# Altium project DM3370.PrjPcb (part 14 of 14)
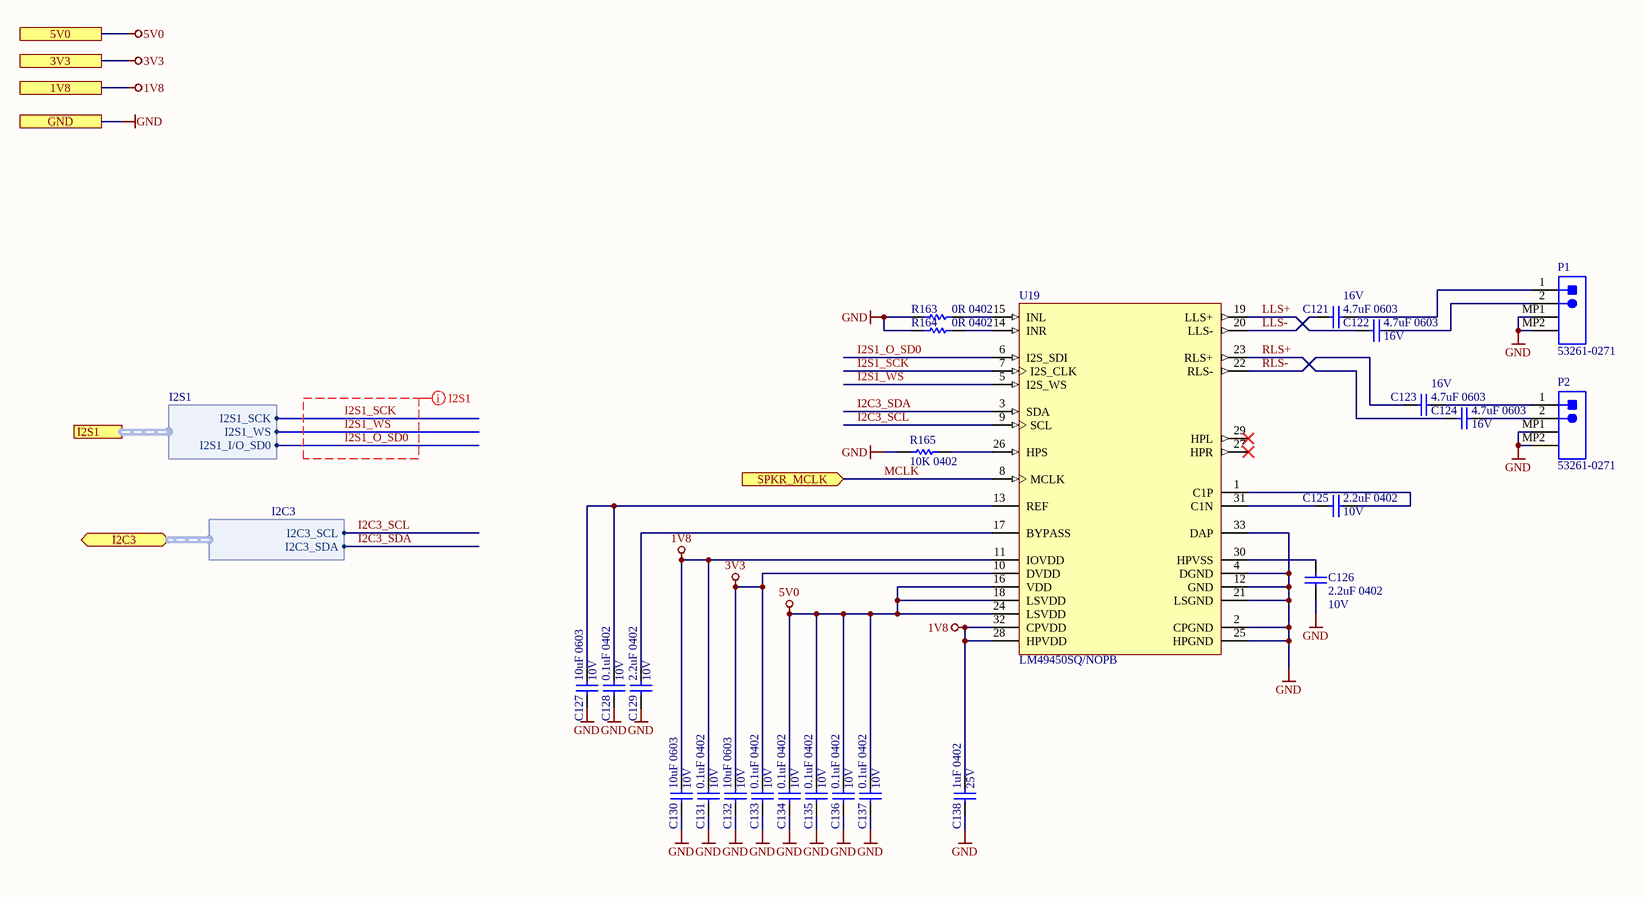
[diagram p18: DM3370_speaker.SchDoc]

## Nets that join several sheets
1V0: DM3370_IMX214 (FB6.1), DM3370_Power (C119.2 R64.2 TP33.1 U10.10)
1V2: DM3370_OV9782_1-2 (FB9.1 FB12.1), DM3370_OV9782_3-4 (FB15.1 FB18.1), DM3370_Power (C120.2 R67.1 TP34.1 U10.8)
1V8: DM3370_EEPROM_Add (5 pins), DM3370_Connector_B (9 pins), DM3370_Connector_C (R52.1), DM3370_IMU_BMI270 (9 pins), DM3370_LCD_LEDring (11 pins), DM3370_Motor (9 pins), DM3370_OV9782_1-2 (FB8.1 FB11.1), DM3370_OV9782_3-4 (FB14.1 FB17.1), DM3370_PCIe (10 pins), DM3370_IMX214 (FB5.1), DM3370_Power (5 pins), DM3370_I2S_MICS (6 pins), DM3370_speaker (6 pins)
2V8: DM3370_LCD_LEDring (FB19.1), DM3370_OV9782_1-2 (R19.1 R170.1), DM3370_OV9782_3-4 (R177.1 R178.1), DM3370_IMX214 (R199.1), DM3370_Power (C31.2 TP2.1 U7.5)
3V3: DM3370_IMU_BMI270 (5 pins), DM3370_LCD_LEDring (FB7.1), DM3370_PCIe (9 pins), DM3370_Power (5 pins), DM3370_USB (26 pins), DM3370_PCIE_CLK (30 pins), DM3370_speaker (C132.2 C133.2 U19.10)
5V0: DM3370_Connector_B (J3.30), DM3370_Connector_C (R4.2), DM3370_LCD_LEDring (7 pins), DM3370_Motor (8 pins), DM3370_Power (6 pins), DM3370_USB (8 pins), DM3370_speaker (7 pins)
11V: DM3370_Motor (FB21.1), DM3370_Power (6 pins)
BB_SYS: DM3370_Connector_A (12 pins), DM3370_Power (36 pins)
GND: TopLevel (MTG1.1 MTG2.1 MTG3.1 MTG4.1), DM3370_EEPROM_Add (6 pins), DM3370_Connector_A (31 pins), DM3370_Connector_B (39 pins), DM3370_Connector_C (26 pins), DM3370_IMU_BMI270 (14 pins), DM3370_LCD_LEDring (30 pins), DM3370_Motor (26 pins), DM3370_OV9782_1-2 (35 pins), DM3370_OV9782_3-4 (35 pins), DM3370_PCIe (25 pins), DM3370_IMX214 (18 pins), DM3370_Power (84 pins), DM3370_USB (64 pins), DM3370_PCIE_CLK (38 pins), DM3370_I2S_MICS (21 pins), DM3370_speaker (26 pins)
P_VBUS: DM3370_Power (C139.1 U8.1 U8.24), DM3370_USB (7 pins)
VBAT: DM3370_Connector_A (J1.2), DM3370_Power (12 pins)
BACK_LIGHT: DM3370_Connector_C (J5.50), DM3370_LCD_LEDring (Q7.1 R145.2)
BMI270_CS_1V8: DM3370_Connector_C (J5.70), DM3370_IMU_BMI270 (U1.12 U26.18)
BMI270_INT_1V8: DM3370_Connector_B (J3.61), DM3370_IMU_BMI270 (U1.4 U26.14)
BMI270_MISO_1V8: DM3370_Connector_C (J5.60), DM3370_IMU_BMI270 (U1.1 U26.20)
BMI270_MOSI_1V8: DM3370_Connector_C (J5.58), DM3370_IMU_BMI270 (U1.14 U26.17)
BMI270_SCK_1V8: DM3370_Connector_C (J5.68), DM3370_IMU_BMI270 (U1.13 U26.19)
BMI270_WAKE_1V8: DM3370_Connector_B (J3.65), DM3370_IMU_BMI270 (U1.9 U26.6)
BNO08x_BOOTN_1V8: DM3370_Connector_B (J3.56), DM3370_IMU_BMI270 (R183.1 TP42.1 U26.4)
BNO08x_RSTn_1V8: DM3370_Connector_B (J3.59), DM3370_IMU_BMI270 (U26.11)
CAM_A_CLK: DM3370_Connector_C (J5.38), DM3370_IMX214 (J13.3)
CAM_A_PWR: DM3370_Connector_C (J5.26), DM3370_OV9782_1-2 (J14.9 R131.1)
CAM_D_PWR: DM3370_Connector_C (J5.28), DM3370_OV9782_1-2 (J15.9 R132.1)
CAM_E_PWR: DM3370_Connector_C (J5.66), DM3370_IMX214 (J13.9 R126.1)
CAM_FS_A: DM3370_Connector_C (J5.52 R20.2), DM3370_IMX214 (J13.8)
CAM_FS_ST: DM3370_Connector_C (J5.48 R18.2), DM3370_OV9782_1-2 (R135.2), DM3370_OV9782_3-4 (R144.2)
CAM_L_PWR: DM3370_Connector_C (J5.64), DM3370_OV9782_3-4 (J16.9 R140.1)
CAM_R_PWR: DM3370_Connector_C (J5.62), DM3370_OV9782_3-4 (J17.9 R141.1)
CAM_ST_CLK: DM3370_Connector_C (J5.36), DM3370_OV9782_1-2 (R159.1 R160.1), DM3370_OV9782_3-4 (R161.1 R162.1)
CHG_INT: DM3370_Connector_A (J1.70), DM3370_Power (R70.2 U8.7)
D/C: DM3370_Connector_C (J5.42), DM3370_LCD_LEDring (U25.5)
GGE_INT: DM3370_Connector_A (J1.72), DM3370_Power (R198.2 U18.12)
I2C0_SCL: DM3370_EEPROM_Add (U17.6), DM3370_Connector_A (J1.27), DM3370_OV9782_3-4 (J16.7)
I2C0_SDA: DM3370_EEPROM_Add (U17.5), DM3370_Connector_A (J1.29), DM3370_OV9782_3-4 (J16.5)
I2C1_SCL: DM3370_Connector_B (J3.39), DM3370_OV9782_1-2 (J14.7)
I2C1_SDA: DM3370_Connector_B (J3.41), DM3370_OV9782_1-2 (J14.5)
I2C2_SCL: DM3370_Connector_A (J1.98), DM3370_IMX214 (J13.7)
I2C2_SDA: DM3370_Connector_A (J1.100), DM3370_IMX214 (J13.5)
I2C3_SCL: DM3370_Connector_C (J5.96), DM3370_OV9782_1-2 (J15.7), DM3370_PCIe (U4.4), DM3370_speaker (U19.9)
I2C3_SCL_3V3: DM3370_PCIe (R49.2 R55.1 U4.1), DM3370_PCIE_CLK (U14.19 U15.8)
I2C3_SDA: DM3370_Connector_C (J5.98), DM3370_OV9782_1-2 (J15.5), DM3370_PCIe (U4.5), DM3370_speaker (U19.3)
I2C3_SDA_3V3: DM3370_PCIe (R47.2 R54.1 U4.8), DM3370_PCIE_CLK (U14.20 U15.9)
I2C4_SCL: DM3370_Connector_B (J4.2), DM3370_Connector_C (J5.90), DM3370_OV9782_3-4 (J17.7), DM3370_Power (U8.5 U18.2)
I2C4_SDA: DM3370_Connector_B (J4.4), DM3370_Connector_C (J5.92), DM3370_OV9782_3-4 (J17.5), DM3370_Power (U8.6 U18.1)
I2S0_I/O_SD0: DM3370_Connector_B (J3.49), DM3370_I2S_MICS (MIC1.6 MIC2.6)
I2S0_I/O_SD1: DM3370_Connector_B (J3.47), DM3370_I2S_MICS (MIC3.6 MIC4.6)
I2S0_I/O_SD2: DM3370_Connector_B (J3.53), DM3370_I2S_MICS (MIC5.6 MIC6.6)
I2S0_SCK: DM3370_Connector_B (J3.51), DM3370_I2S_MICS (6 pins)
I2S0_WS: DM3370_Connector_B (J3.45), DM3370_I2S_MICS (6 pins)
I2S1_O_SD0: DM3370_Connector_B (J3.54), DM3370_speaker (U19.6)
I2S1_SCK: DM3370_Connector_C (J5.22), DM3370_speaker (U19.7)
I2S1_WS: DM3370_Connector_C (J5.24), DM3370_speaker (U19.5)
KB_PG: DM3370_Connector_A (J1.36), DM3370_Connector_B (J4.5)
KBIO_40: DM3370_Connector_B (J3.80), DM3370_USB (TP27.1 U13.6)
KBIO_41: DM3370_Connector_B (J3.89), DM3370_Motor (U2.6)
KBIO_42: DM3370_Connector_B (J3.83), DM3370_Motor (U20.4)
KBIO_43: DM3370_Connector_B (J3.85), DM3370_Motor (U20.5)
KBIO_44: DM3370_Connector_B (J3.78), DM3370_USB (Q4.1 R200.2)
KBIO_45: DM3370_Connector_B (J3.91), DM3370_Motor (U3.6)
KBIO_46: DM3370_Connector_B (J3.79), DM3370_Motor (U20.2)
KBIO_47: DM3370_Connector_B (J3.81), DM3370_Motor (U20.3)
MCLK: DM3370_Connector_C (J5.40), DM3370_speaker (U19.8)
MIPI_RX0_C_N: DM3370_Connector_B (J3.84), DM3370_IMX214 (J13.20)
MIPI_RX0_C_P: DM3370_Connector_B (J3.86), DM3370_IMX214 (J13.19)
MIPI_RX0_D0_N: DM3370_Connector_B (J3.96), DM3370_IMX214 (J13.26)
MIPI_RX0_D0_P: DM3370_Connector_B (J3.98), DM3370_IMX214 (J13.25)
MIPI_RX0_D1_N: DM3370_Connector_B (J3.90), DM3370_IMX214 (J13.22)
MIPI_RX0_D1_P: DM3370_Connector_B (J3.92), DM3370_IMX214 (J13.23)
MIPI_RX1_D0_N: DM3370_Connector_B (J3.66), DM3370_IMX214 (J13.16)
MIPI_RX1_D0_P: DM3370_Connector_B (J3.68), DM3370_IMX214 (J13.17)
MIPI_RX1_D1_N: DM3370_Connector_B (J3.60), DM3370_IMX214 (J13.14)
MIPI_RX1_D1_P: DM3370_Connector_B (J3.62), DM3370_IMX214 (J13.13)
MIPI_RX2_C_N: DM3370_Connector_C (J5.79), DM3370_OV9782_3-4 (J16.20)
MIPI_RX2_C_P: DM3370_Connector_C (J5.77), DM3370_OV9782_3-4 (J16.19)
MIPI_RX2_D0_N: DM3370_Connector_C (J5.67), DM3370_OV9782_3-4 (J16.26)
MIPI_RX2_D0_P: DM3370_Connector_C (J5.65), DM3370_OV9782_3-4 (J16.25)
MIPI_RX2_D1_N: DM3370_Connector_C (J5.73), DM3370_OV9782_3-4 (J16.22)
MIPI_RX2_D1_P: DM3370_Connector_C (J5.71), DM3370_OV9782_3-4 (J16.23)
MIPI_RX3_C_N: DM3370_Connector_C (J5.85), DM3370_OV9782_3-4 (J17.20)
MIPI_RX3_C_P: DM3370_Connector_C (J5.83), DM3370_OV9782_3-4 (J17.19)
MIPI_RX3_D0_N: DM3370_Connector_C (J5.91), DM3370_OV9782_3-4 (J17.26)
MIPI_RX3_D0_P: DM3370_Connector_C (J5.89), DM3370_OV9782_3-4 (J17.25)
MIPI_RX3_D1_N: DM3370_Connector_C (J5.97), DM3370_OV9782_3-4 (J17.22)
MIPI_RX3_D1_P: DM3370_Connector_C (J5.95), DM3370_OV9782_3-4 (J17.23)
MIPI_RX4_C_N: DM3370_Connector_A (J1.47), DM3370_OV9782_1-2 (J15.20)
MIPI_RX4_C_P: DM3370_Connector_A (J1.45), DM3370_OV9782_1-2 (J15.19)
MIPI_RX4_D0_N: DM3370_Connector_A (J1.35), DM3370_OV9782_1-2 (J15.26)
MIPI_RX4_D0_P: DM3370_Connector_A (J1.33), DM3370_OV9782_1-2 (J15.25)
MIPI_RX4_D1_N: DM3370_Connector_A (J1.41), DM3370_OV9782_1-2 (J15.22)
MIPI_RX4_D1_P: DM3370_Connector_A (J1.39), DM3370_OV9782_1-2 (J15.23)
MIPI_RX5_C_N: DM3370_Connector_A (J1.53), DM3370_OV9782_1-2 (J14.20)
MIPI_RX5_C_P: DM3370_Connector_A (J1.51), DM3370_OV9782_1-2 (J14.19)
MIPI_RX5_D0_N: DM3370_Connector_A (J1.59), DM3370_OV9782_1-2 (J14.26)
MIPI_RX5_D0_P: DM3370_Connector_A (J1.57), DM3370_OV9782_1-2 (J14.25)
MIPI_RX5_D1_N: DM3370_Connector_A (J1.65), DM3370_OV9782_1-2 (J14.22)
MIPI_RX5_D1_P: DM3370_Connector_A (J1.63), DM3370_OV9782_1-2 (J14.23)
PCIe1_KB_CLK_IN_N: DM3370_Connector_B (R42.1), DM3370_PCIE_CLK (R102.2 R107.2)
PCIe1_KB_CLK_IN_P: DM3370_Connector_B (R40.1), DM3370_PCIE_CLK (R100.2 R106.1)
PCIe1_WIFI_CLK_IN_N: DM3370_PCIe (R93.1), DM3370_PCIE_CLK (R99.2 R109.2)
PCIe1_WIFI_CLK_IN_P: DM3370_PCIe (R45.1), DM3370_PCIE_CLK (R98.2 R108.2)
PCIe2_KB_CLK_IN_N: DM3370_Connector_B (R44.1), DM3370_PCIE_CLK (R117.2 R121.2)
PCIe2_KB_CLK_IN_P: DM3370_Connector_B (R41.1), DM3370_PCIE_CLK (R116.2 R120.1)
PCIe2_WIFI_CLK_IN_N: DM3370_PCIe (R153.1), DM3370_PCIE_CLK (R115.2 R123.2)
PCIe2_WIFI_CLK_IN_P: DM3370_PCIe (R46.1), DM3370_PCIE_CLK (R114.2 R122.2)
PCIe_3V3_CLKREQ: DM3370_Connector_A (J1.66), DM3370_PCIe (J9.53)
PCIe_3V3_PERST: DM3370_Connector_A (J1.64), DM3370_PCIe (J9.52)
PCIe_3V3_PEWAKE0: DM3370_Connector_A (J1.68), DM3370_PCIe (J9.55)
PCIE_CRX0_N: DM3370_Connector_B (J3.11), DM3370_PCIe (J9.43)
PCIE_CRX0_P: DM3370_Connector_B (J3.9), DM3370_PCIe (J9.41)
PCIE_CRX1_N: DM3370_Connector_B (J3.17), DM3370_PCIe (J9.67)
PCIE_CRX1_P: DM3370_Connector_B (J3.15), DM3370_PCIe (J9.65)
PCIE_CTX0_N: DM3370_Connector_B (J3.27), DM3370_PCIe (R38.1)
PCIE_CTX0_P: DM3370_Connector_B (J3.29), DM3370_PCIe (R37.1)
PCIE_CTX1_N: DM3370_Connector_B (J3.33), DM3370_PCIe (R50.1)
PCIE_CTX1_P: DM3370_Connector_B (J3.35), DM3370_PCIe (R48.1)
PCIE_RC_REF_CLK_N: DM3370_Connector_B (J3.5), DM3370_PCIe (R77.1)
PCIE_RC_REF_CLK_P: DM3370_Connector_B (J3.3), DM3370_PCIe (R75.1)
PWM_0: DM3370_Connector_C (J5.32), DM3370_Motor (R169.1 U2.5)
PWM_1: DM3370_Connector_C (J5.30), DM3370_Motor (R186.1 U3.5)
RESET_LCD: DM3370_Connector_C (J5.44), DM3370_LCD_LEDring (U25.6)
S_CLR: DM3370_Connector_A (J1.60), DM3370_Power (M4.1 R167.2)
S_INT: DM3370_Connector_A (J1.32), DM3370_Power (R58.1 U5.5)
SPI2_SCK: DM3370_Connector_B (J3.69), DM3370_LCD_LEDring (R118.2 U25.3)
SPI2_SIO0: DM3370_Connector_B (J3.73), DM3370_LCD_LEDring (R171.2 U25.1)
SPI2_SIO1: DM3370_Connector_B (J3.75), DM3370_LCD_LEDring (R172.2)
SPI2_SS_0: DM3370_Connector_B (J3.71), DM3370_LCD_LEDring (R166.2)
SPI2_SS_1: DM3370_Connector_B (J3.63), DM3370_LCD_LEDring (R173.2 U25.4)
UART2_CTS: DM3370_Connector_C (J5.84), DM3370_PCIe (J9.36)
UART2_RTS: DM3370_Connector_C (J5.86), DM3370_PCIe (J9.34)
UART2_RX: DM3370_Connector_C (J5.80), DM3370_PCIe (J9.32)
UART2_TX: DM3370_Connector_C (J5.82), DM3370_PCIe (J9.22)
UART2_WAKE: DM3370_Connector_A (J1.54), DM3370_PCIe (J9.20)
USB_D_N: DM3370_Connector_B (J3.12), DM3370_USB (U22.2)
USB_D_P: DM3370_Connector_B (J3.10), DM3370_USB (U22.1)
USB_M.2_D_N: DM3370_PCIe (J9.5), DM3370_USB (U21.28)
USB_M.2_D_P: DM3370_PCIe (J9.3), DM3370_USB (U21.1)
USB_RX_N: DM3370_Connector_B (J3.18), DM3370_USB (U12.3)
USB_RX_P: DM3370_Connector_B (J3.16), DM3370_USB (U12.4)
USB_TX_N: DM3370_Connector_B (J3.6), DM3370_USB (U12.7)
USB_TX_P: DM3370_Connector_B (J3.4), DM3370_USB (U12.8)
WIFI_3V3_W_DISABLE: DM3370_Connector_A (J1.62), DM3370_PCIe (J9.56)
WS2812_DI: DM3370_Connector_B (J3.97 R1.2), DM3370_LCD_LEDring (U23.5)
WS2812_DO4: DM3370_Connector_B (J3.95 R2.2), DM3370_LCD_LEDring (R158.2)

## Assembly variants
Production: not fitted B1 C7 C12 C121 C122 D1 FB7 J4 OS2 P1 R5 R6 R14 R15 R16 R17 R23 R26 R40 R42 R45 R75 R77 R82 R83 R93 R104 R105 R118 R147 R148 R150 R154 R155 R158 R166 R171 R172 R173 R180 R181 R182 R183 R191 R194 U1 U14